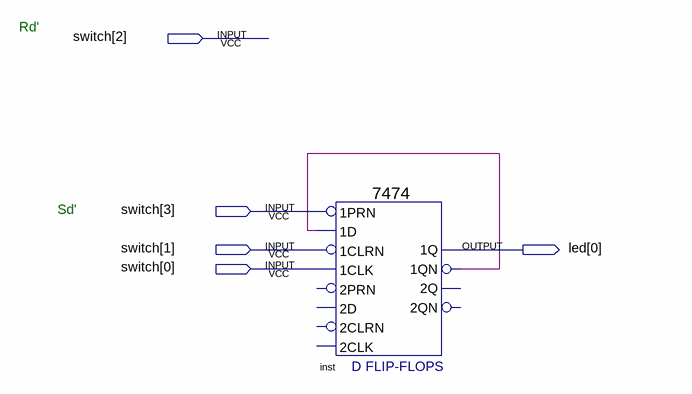
[diagram p0: schematic sheet]
// Quartus schematic pj602.bdf as structural Verilog: 1 symbols, 5 pins
module pj602 (
  input  [3:0] switch,
  output [0:0] led
);

  wire inst_1qn;

  \7474  inst (
    .\1CLK (switch[0]), .\1D (inst_1qn), .\1PRN (switch[3]), .\1CLRN (switch[1]), .\1QN (inst_1qn),
    .\1Q (led[0]));  // open: 2D, 2PRN, 2CLK, 2CLRN, 2Q, 2QN

  // Notes on the sheet:
  //   Rd'
  //   Sd'
endmodule
